# Altium schematic sheet STM32F103C8T6.SchDoc
size A3; SheetNumber: 4; SheetTotal: 4
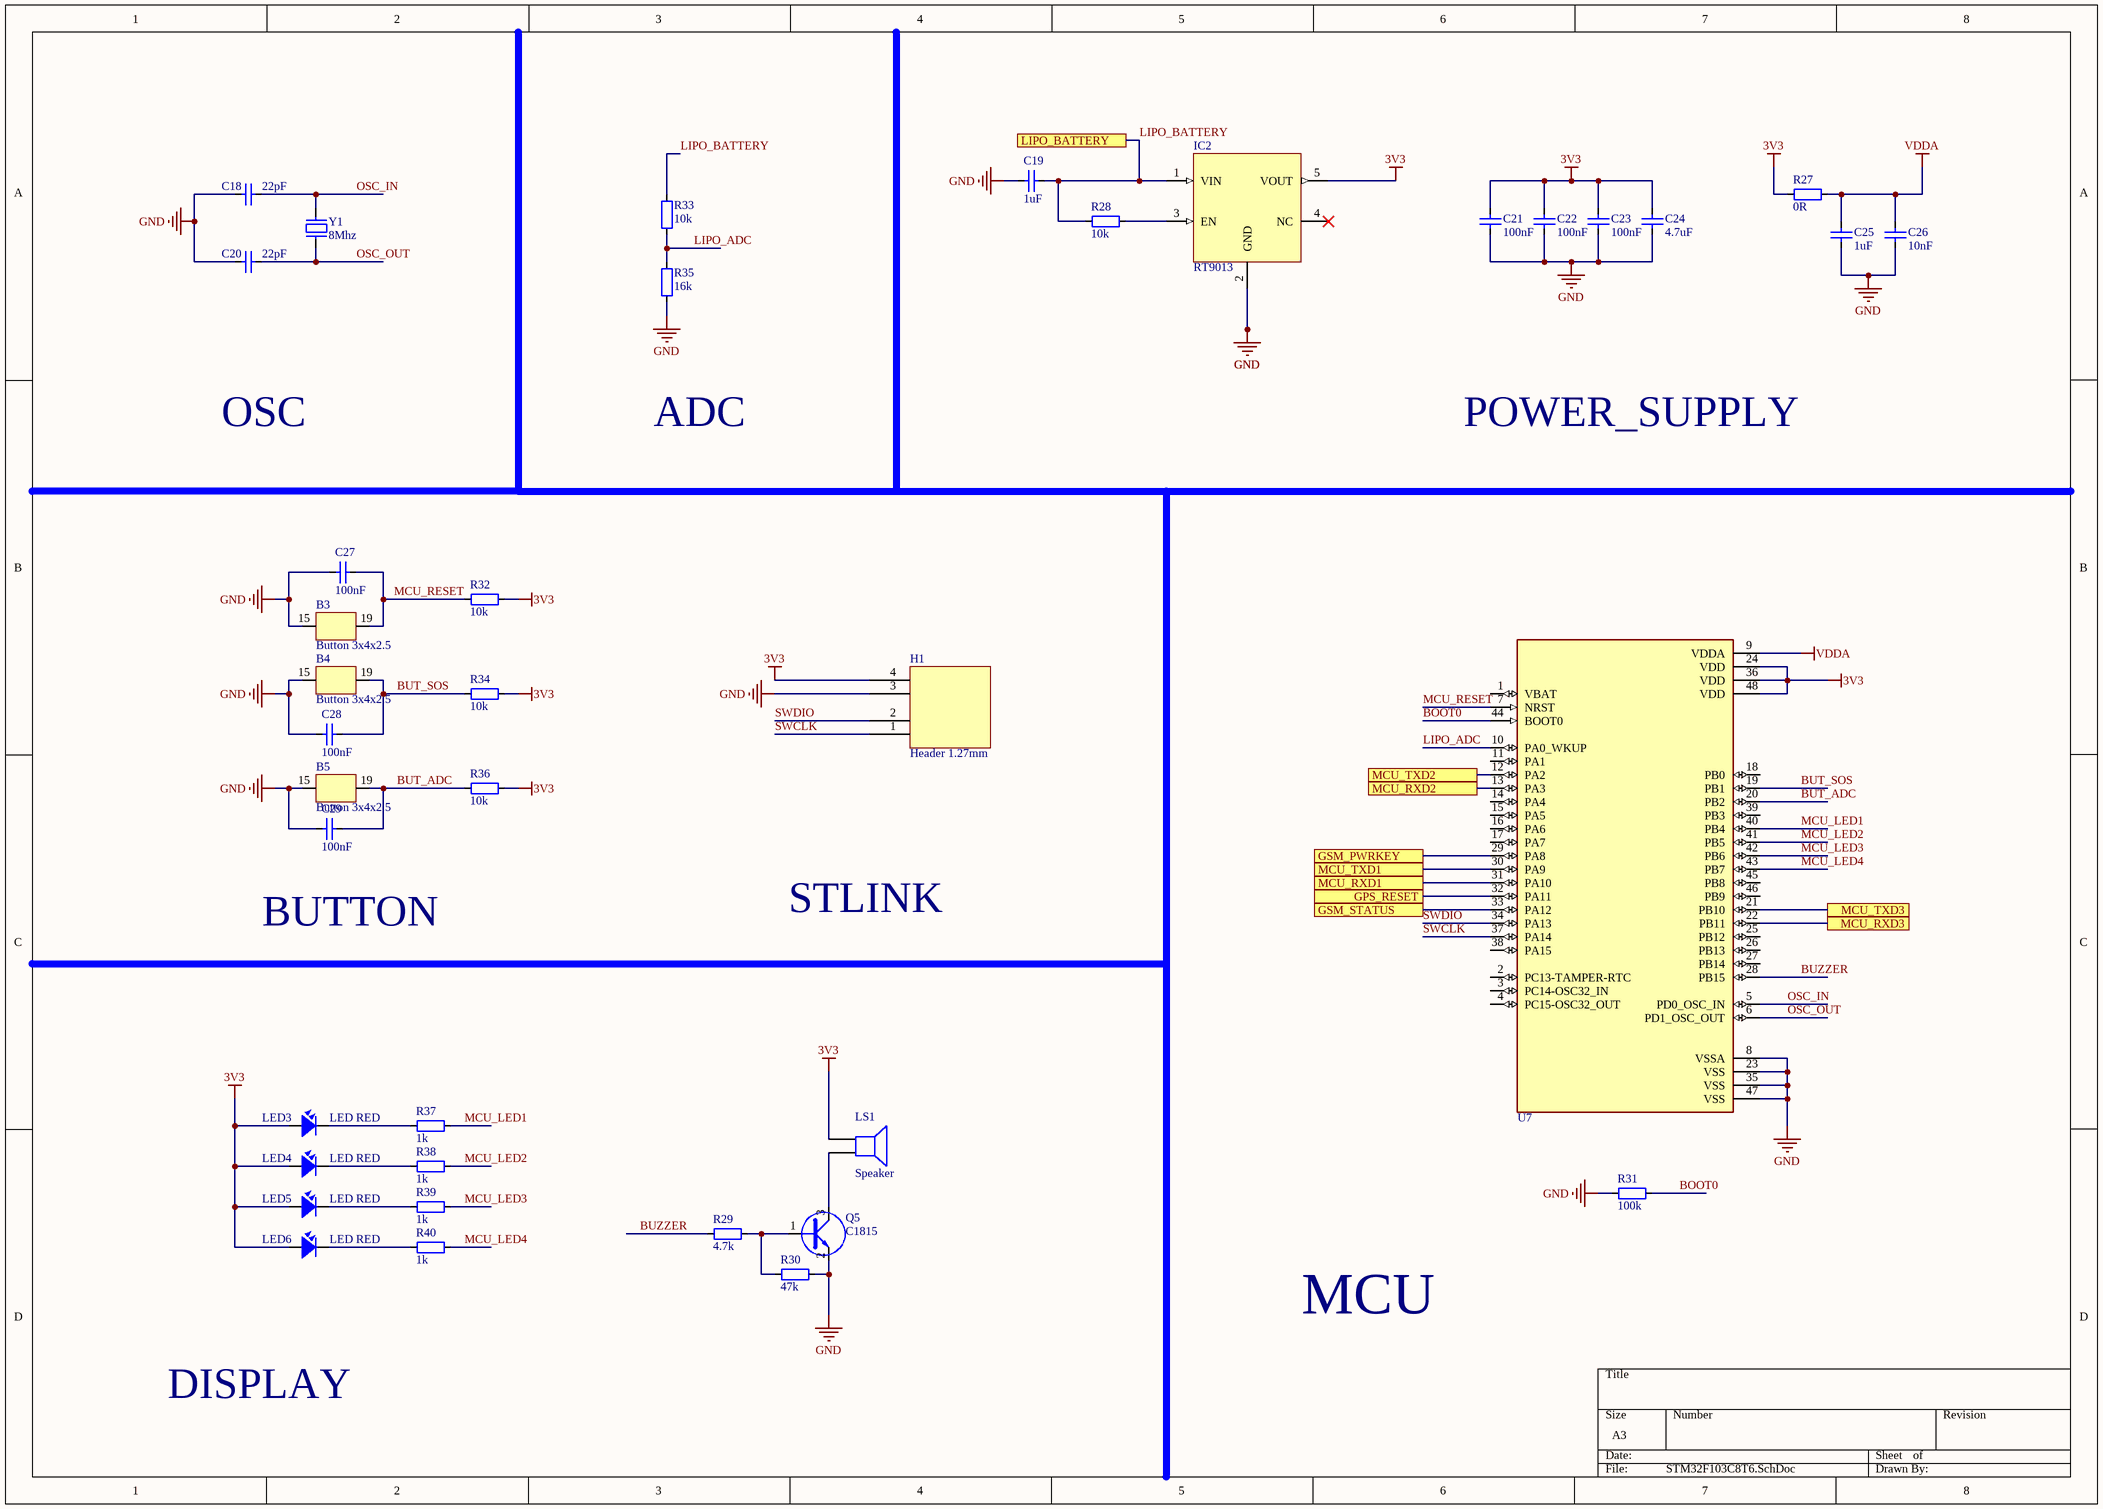
[diagram p0: STM32F103C8T6.SchDoc]

## Parts
B3  Button 3x4x2.5  [Button 3x4x2.5]
B4  Button 3x4x2.5  [Button 3x4x2.5]
B5  Button 3x4x2.5  [Button 3x4x2.5]
C18  22pF  [CAP_0805]
C19  1uF  [CAP_0805]
C20  22pF  [CAP_0805]
C21  100nF  [CAP_0805]
C22  100nF  [CAP_0805]
C23  100nF  [CAP_0805]
C24  4.7uF  [CAP_0805]
C25  1uF  [CAP_0805]
C26  10nF  [CAP_0805]
C27  100nF  [CAP_0805]
C28  100nF  [CAP_0805]
C29  100nF  [CAP_0805]
H1  Header 1.27mm  [Header 1.27mm]
IC2  RT9013  [SOT23-5]
LED3  LED RED  [LED-0805-Red]
LED4  LED RED  [LED-0805-Red]
LED5  LED RED  [LED-0805-Red]
LED6  LED RED  [LED-0805-Red]
LS1  Speaker  [SPEAKER]
Q5  C1815  [SOT23D]
R27  0R  [RES-SMD-0805]
R28  10k  [RES-SMD-0805]
R29  4.7k  [RES-SMD-0805]
R30  47k  [RES-SMD-0805]
R31  100k  [RES-SMD-0805]
R32  10k  [RES-SMD-0805]
R33  10k  [RES-SMD-0805]
R34  10k  [RES-SMD-0805]
R35  16k  [RES-SMD-0805]
R36  10k  [RES-SMD-0805]
R37  1k  [RES-SMD-0805]
R38  1k  [RES-SMD-0805]
R39  1k  [RES-SMD-0805]
R40  1k  [RES-SMD-0805]
U7  STM32  [LQFP 48]  (value not drawn)
Y1  8Mhz  [Thach Anh 2 chan SMD5032]

## Ports
GPS_RESET, GSM_PWRKEY, GSM_STATUS, LIPO_BATTERY, MCU_RXD1, MCU_RXD2, MCU_RXD3, MCU_TXD1, MCU_TXD2, MCU_TXD3

## Nets
3V3: C21.2 C22.2 C23.2 C24.2 H1.4 IC2.5(VOUT) LED3.1 LED4.1 LED5.1 LED6.1 LS1.1 R27.2 R32.1 R34.1 R36.1 U7.24(VDD) U7.36(VDD) U7.48(VDD)
GND: B3.15 B4.15 B5.15 C18.1 C19.1 C20.1 C21.1 C22.1 C23.1 C24.1 C25.1 C26.1 C27.1 C28.1 C29.1 H1.3 IC2.2(GND) Q5.2(E) R30.2 R31.2 R35.2 U7.8(VSSA) U7.23(VSS) U7.35(VSS) U7.47(VSS)
VDDA: C25.2 C26.2 R27.1 U7.9(VDDA)
BOOT0: R31.1 U7.44(BOOT0)
BUT_ADC: B5.19 C29.2 R36.2 U7.20(PB2)
BUT_SOS: B4.19 C28.2 R34.2 U7.19(PB1)
BUZZER: R29.1 U7.28(PB15)
GPS_RESET: U7.32(PA11) ; port GPS_RESET
GSM_PWRKEY: U7.29(PA8) ; port GSM_PWRKEY
GSM_STATUS: U7.33(PA12) ; port GSM_STATUS
LIPO_ADC: R33.2 R35.1 U7.10(PA0_WKUP)
LIPO_BATTERY: C19.2 IC2.1(VIN) R28.2 R33.1 ; port LIPO_BATTERY
MCU_LED1: R37.1 U7.40(PB4)
MCU_LED2: R38.1 U7.41(PB5)
MCU_LED3: R39.1 U7.42(PB6)
MCU_LED4: R40.1 U7.43(PB7)
MCU_RESET: B3.19 C27.2 R32.2 U7.7(NRST)
MCU_RXD1: U7.31(PA10) ; port MCU_RXD1
MCU_RXD2: U7.13(PA3) ; port MCU_RXD2
MCU_RXD3: U7.22(PB11) ; port MCU_RXD3
MCU_TXD1: U7.30(PA9) ; port MCU_TXD1
MCU_TXD2: U7.12(PA2) ; port MCU_TXD2
MCU_TXD3: U7.21(PB10) ; port MCU_TXD3
OSC_IN: C18.2 U7.5(PD0_OSC_IN) Y1.2
OSC_OUT: C20.2 U7.6(PD1_OSC_OUT) Y1.1
SWCLK: H1.1 U7.37(PA14)
SWDIO: H1.2 U7.34(PA13)
NetIC2_3: IC2.3(EN) R28.1
NetLED3_2: LED3.2 R37.2
NetLED4_2: LED4.2 R38.2
NetLED5_2: LED5.2 R39.2
NetLED6_2: LED6.2 R40.2
NetLS1_2: LS1.2 Q5.3(C)
NetQ5_1: Q5.1(B) R29.2 R30.1

Not connected (* = marked no-connect by the designer): IC2 4(NC)*; U7 1(VBAT) 2(PC13-TAMPER-RTC) 3(PC14-OSC32_IN) 4(PC15-OSC32_OUT) 11(PA1) 14(PA4) 15(PA5) 16(PA6) 17(PA7) 18(PB0) 25(PB12) 26(PB13) 27(PB14) 38(PA15) 39(PB3) 45(PB8) 46(PB9)

## Notes on the sheet
- OSC
- ADC
- POWER_SUPPLY
- STLINK
- BUTTON
- MCU
- DISPLAY

## Library data of the parts
C18-C29 = CapSMD: Capacitor; Value: 33p; Published: 8-Jun-2000; LatestRevisionDate: 17-Jul-2002; LatestRevisionNote: Re-released for DXP Platform.; PackageReference: RAD-0.3; Publisher: Altium Limited
IC2 = RT9013: RT9013-33GB IC REG LINEAR 3.3V 500mA SOT23-5
LED3-LED6 = LED: LED Single colour Green and Red; Value: LED 3 ly Single Colour
LS1 = Speaker: Còi chíp 3V; Published: 24-Mar-1999; LatestRevisionDate: 17-Jul-2002; LatestRevisionNote: Re-released for DXP Platform.; PackageReference: PIN2; Publisher: Altium Limited
Q5 = 2SC1815: NPN 600mW, ECB; Value: C1815
R27-R40 = Resistor - SMD: Resistor; Manufacturer: Generic Components; Class: Passive; Published: 08/06/2000; Publisher: Altium Hobart Technology Centre
U7 = STM32F103C8T6: STM32 ARM-based 32-bit MCU with 64 Kbytes Flash, 64-pin LQFP, Industrial Temperature
Y1 = Thach Anh 2 chan SMD 5032: Crystal For all Crystal 2pin.; Value: 4Mhz